# Altium project OSV PSB V2I1.PrjPcb (part 3 of 3)
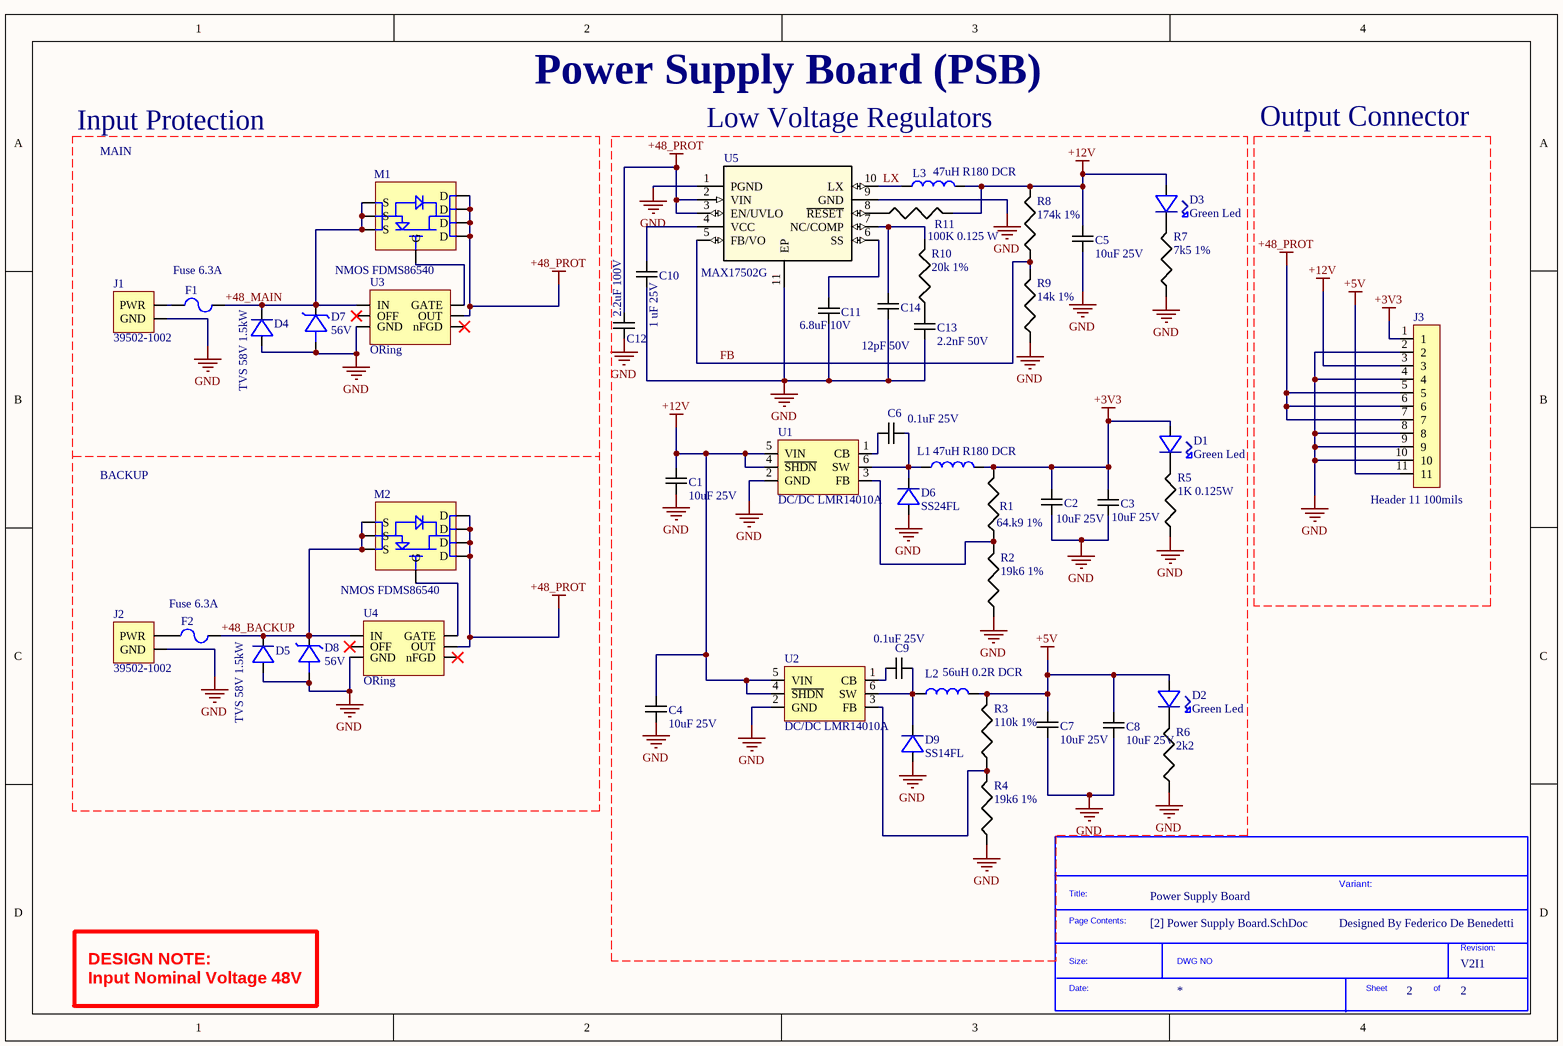
[diagram p3: [2] Power Supply Board.SchDoc]

## Sheet [2] Power Supply Board.SchDoc (continued)

### Library data of the parts (continued)
R10 = ERJ-6ENF2002V: Res Thick Film 0805 20K OHM 1% 1/8W 0805; Manufacturer: Panasonic; Resistance: 20kR; Power Rating: 125mW; Voltage Rating: 150V; Temperature Coefficient: 100ppm/°C; Supplier 1: Digi-Key; Manufacturer Part Number: ERJ-6ENF2002V; RoHS: Yes; Category: Chip SMD Resistors; Stock 1: 254204; Pricing 1: 1=0,10000, 10=0,07200, 100=0,02750, 1000=0,01210, 2500=0,01045 (USD); Mount: Surface Mount; Case/Package: 0805; Case Code (Metric): 2012; Case Code (Imperial): 0805; Contact Plating: Tin; Min Operating Temperature: -55°C; Max Operating Temperature: 155°C; Tolerance: 1%; Packaging: Tape and Reel; Package Quantity: 1; Composition: Thick Film; Number of Terminations: 2; Military Standard: Not; Termination: SMD/SMT; Max Power Dissipation: 125mW; Voltage Rating (DC): 150V; Features: Automotive AEC-Q200; Working Voltage: 150V; Length: 2mm; Height: 0.6mm; Width: 0.049inch; Depth: 1.25mm; Radiation Hardening: No; REACH SVHC: No SVHC; Lead Free: Lead Free; ComponentLink1URL: https://datasheet.ciiva.com/11821/0900766b80f80784-11821565.pdf?src-supplier=RSComponents; ComponentLink1Description: https://datasheet.ciiva.com/11821/0900766b80f80784-11821565.pdf?src-supplier=RSComponents; ComponentLink2URL: https://datasheet.ciiva.com/48531/aoa0000ce2-48531785.pdf?src-supplier=Avnet; ComponentLink2Description: https://datasheet.ciiva.com/48531/aoa0000ce2-48531785.pdf?src-supplier=Avnet; ComponentLink3URL: https://datasheet.ciiva.com/15159/getdatasheetpartid-249649-15159066.pdf?src-supplier=Verical; ComponentLink3Description: https://datasheet.ciiva.com/15159/getdatasheetpartid-249649-15159066.pdf?src-supplier=Verical; ComponentLink4URL: https://datasheet.ciiva.com/17211/aoa0000ce2-17211115.pdf?src-supplier=Avnet+Europe; ComponentLink4Description: https://datasheet.ciiva.com/17211/aoa0000ce2-17211115.pdf?src-supplier=Avnet+Europe; ComponentLink5URL: https://datasheet.ciiva.com/46389/426256-46389083.pdf?src-supplier=Element14; ComponentLink5Description: https://datasheet.ciiva.com/46389/426256-46389083.pdf?src-supplier=Element14; ComponentLink6URL: https://datasheet.ciiva.com/28688/1678782-28688637.pdf?src-supplier=Element14; ComponentLink6Description: https://datasheet.ciiva.com/28688/1678782-28688637.pdf?src-supplier=Element14; ComponentLink7URL: https://datasheet.ciiva.com/16512/aoa0000ce2-16512158.pdf?src-supplier=Avnet+Asia; ComponentLink7Description: https://datasheet.ciiva.com/16512/aoa0000ce2-16512158.pdf?src-supplier=Avnet+Asia; ComponentLink8URL: https://datasheet.ciiva.com/22749/1678782-22749662.pdf?src-supplier=Element14; ComponentLink8Description: https://datasheet.ciiva.com/22749/1678782-22749662.pdf?src-supplier=Element14; ComponentLink9URL: https://datasheet.ciiva.com/30072/aoa0000ce2-30072453.pdf?src-supplier=Onlinecomponents.com; ComponentLink9Description: https://datasheet.ciiva.com/30072/aoa0000ce2-30072453.pdf?src-supplier=Onlinecomponents.com; ComponentLink10URL: https://datasheet.ciiva.com/43460/426256-43460054.pdf?src-supplier=Farnell; ComponentLink10Description: https://datasheet.ciiva.com/43460/426256-43460054.pdf?src-supplier=Farnell; ComponentLink11URL: https://datasheet.ciiva.com/16786/70260748-16786968.pdf?src-supplier=Allied+Electronics; ComponentLink11Description: https://datasheet.ciiva.com/16786/70260748-16786968.pdf?src-supplier=Allied+Electronics; ComponentLink12URL: https://datasheet.ciiva.com/9192/aoa0000ce2-9192153.pdf?src-supplier=Avnet; ComponentLink12Description: https://datasheet.ciiva.com/9192/aoa0000ce2-9192153.pdf?src-supplier=Avnet; ComponentLink13URL: https://datasheet.ciiva.com/46377/426256-46377356.pdf?src-supplier=Element14; ComponentLink13Description: https://datasheet.ciiva.com/46377/426256-46377356.pdf?src-supplier=Element14; ComponentLink14URL: https://datasheet.ciiva.com/24025/aoa0000ce2-24025709.pdf?src-supplier=Mouser; ComponentLink14Description: https://datasheet.ciiva.com/24025/aoa0000ce2-24025709.pdf?src-supplier=Mouser; Supplier Part Number 1: P20.0KCCT-ND
R11 = ERJ-6ENF1003V: Res Thick Film 0805 100K Ohm 1% 0.125W(1/8W) ±100ppm/C Molded SMD Automotive Punched T/R; Manufacturer: Panasonic; Resistance: 100kR; Power Rating: 125mW; Temperature Coefficient: 100ppm/°C; Voltage Rating (DC): 150V; Supplier 1: Digi-Key; Manufacturer Part Number: ERJ-6ENF1003V; Stock 1: 2355717; Pricing 1: 1=0.1, 10=0.081, 100=0.0311, 1000=0.01367, 2500=0.01181 (USD); Mount: Surface Mount; Case/Package: 0805; Number of Pins: 2; Case Code (Metric): 2012; Case Code (Imperial): 0805; Contact Plating: Tin; Min Operating Temperature: -55°C; Max Operating Temperature: 155°C; Tolerance: 1%; Packaging: Tape and Reel; Number of Terminations: 2; Package Quantity: 1; Voltage Rating: 150V; Composition: Thick Film; Military Standard: Not; Termination: SMD/SMT; Max Power Dissipation: 125mW; Features: Automotive AEC-Q200; Length: 2mm; Height: 0.6mm; Width: 0.049inch; Depth: 1.25mm; Radiation Hardening: No; REACH SVHC: No SVHC; Lead Free: Lead Free; ComponentLink1URL: http://www.farnell.com/datasheets/426256.pdf; ComponentLink1Description: http://www.farnell.com/datasheets/426256.pdf; ComponentLink2URL: http://www.farnell.com/datasheets/1678782.pdf; ComponentLink2Description: http://www.farnell.com/datasheets/1678782.pdf; ComponentLink3URL: http://www.jameco.com/Jameco/Products/ProdDS/1988989.pdf; ComponentLink3Description: http://www.jameco.com/Jameco/Products/ProdDS/1988989.pdf; ComponentLink4URL: http://industrial.panasonic.com/www-data/pdf/AOA0000/AOA0000CE2.pdf; ComponentLink4Description: http://industrial.panasonic.com/www-data/pdf/AOA0000/AOA0000CE2.pdf; ComponentLink5URL: http://www.mouser.com/ds/2/315/AOA0000C283-1093288.pdf; ComponentLink5Description: http://www.mouser.com/ds/2/315/AOA0000C283-1093288.pdf; ComponentLink6URL: https://www.alliedelec.com/m/d/623f45ff1957d936ff56d46fd1c28cac.pdf; ComponentLink6Description: https://www.alliedelec.com/m/d/623f45ff1957d936ff56d46fd1c28cac.pdf; Supplier Part Number 1: P100KCDKR-ND
U1 U2 = LMR14010ADDCR: DC/DC Buck converter; Manufacturer: Texas Instruments; Output Type: Adjustable; Output Configuration: Positive; Number of Outputs: 1; Min Input Voltage: 4V; Max Input Voltage: 40V; Min Output Voltage: 765mV; Output Current: 1A; Switching Frequency: 850kHz; Synchronous Rectifier: No; Core Material: Ferrite; Tolerance: 20%; Inductance: 18uH; Current Rating: 2.45A; Saturation Current: 2A; Shielding: Unshielded; DC Resistance (DCR): 100mR; Self Resonant Frequency: 17.6MHz; Test Frequency: 1MHz; Supplier 1: Digi-Key; Manufacturer Part Number: LMR14010ADDCR; RoHS: No; Stock 1: 3166; Pricing 1: 1=2,34000, 10=2,09900, 25=1,98000, 100=1,58400, 250=1,38600, 500=1,34640, 1000=1,06920 (USD); Mount: Surface Mount; Case/Package: SOT-23-6; Min Operating Temperature: -40°C; Max Operating Temperature: 125°C; Features: UVLO; Packaging: Cut Tape; Max Output Voltage: 40V; ComponentLink1URL: http://www.ti.com/lit/ds/symlink/lmr14010a.pdf?src-supplier=Digi-Key; ComponentLink1Description: http://www.ti.com/lit/ds/symlink/lmr14010a.pdf?src-supplier=Digi-Key; ComponentLink2URL: http://www.ti.com/general/docs/suppproductinfo.tsp?distId=10&amp;gotoUrl=http%3A%2F%2Fwww.ti.com%2Flit%2Fgpn%2Flmr14010a&src-supplier=Digi-Key; ComponentLink2Description: http://www.ti.com/general/docs/suppproductinfo.tsp?distId=10&amp;gotoUrl=http%3A%2F%2Fwww.ti.com%2Flit%2Fgpn%2Flmr14010a&src-supplier=Digi-Key; Supplier Part Number 1: 296-49761-1-ND; Category: Fixed Inductors; Stock 2: 1808; Pricing 2: 1=0,74000, 10=0,64400, 100=0,46000, 500=0,38640 (USD); Composition: Wirewound; RMS Current (Irms): 2.45A; Termination: SMD/SMT; Inductance Tolerance: 20%; Length: 0.307inch; Width: 0.276inch; Height - Seated (Max): 0.217inch; Ratings: AEC-Q200; REACH SVHC: No SVHC; ComponentLink3URL: https://datasheet.ciiva.com/46449/1865596-46449257.pdf?src-supplier=Element14; ComponentLink3Description: https://datasheet.ciiva.com/46449/1865596-46449257.pdf?src-supplier=Element14; ComponentLink4URL: https://datasheet.ciiva.com/48954/70480897-48954489.pdf?src-supplier=Allied+Electronics; ComponentLink4Description: https://datasheet.ciiva.com/48954/70480897-48954489.pdf?src-supplier=Allied+Electronics
U3 U4 = LM5050MK-2/NOPB: IC OR CTRLR N+1 6SOT; Manufacturer: TI National Semiconductor; Quiescent Current: 400uA; Max Supply Voltage: 75V; Min Supply Voltage: 6V; Number of Outputs: 1; Operating Supply Current: 355uA; Max Output Voltage: 12V; Supplier 1: Digi-Key; Manufacturer Part Number: LM5050MK-2/NOPB; RoHS: Yes; Category: Uncategorized; Stock 1: 29342; Pricing 1: 1=2,21000, 10=1,98200, 25=1,87000, 100=1,49600, 250=1,30900, 500=1,27160 (USD); Mount: Surface Mount; Case/Package: SOT-23-6; Number of Pins: 6; Weight: 0.00127oz; Contact Plating: Tin; Min Operating Temperature: -40°C; Max Operating Temperature: 125°C; Packaging: Tape and Reel; Length: 3.05mm; Height: 1mm; Width: 1.75mm; Radiation Hardening: No; Lead Free: Lead Free; REACH SVHC: No SVHC; ComponentLink1URL: https://datasheet.ciiva.com/28632/1787943-28632260.pdf?src-supplier=Element14; ComponentLink1Description: https://datasheet.ciiva.com/28632/1787943-28632260.pdf?src-supplier=Element14; ComponentLink2URL: https://datasheet.ciiva.com/6609/lm5050-2-6609558.pdf?src-supplier=Digi-Key; ComponentLink2Description: https://datasheet.ciiva.com/6609/lm5050-2-6609558.pdf?src-supplier=Digi-Key; ComponentLink3URL: https://datasheet.ciiva.com/12085/lm5050-2-52065-12085161.pdf?src-supplier=Mouser; ComponentLink3Description: https://datasheet.ciiva.com/12085/lm5050-2-52065-12085161.pdf?src-supplier=Mouser; ComponentLink4URL: https://datasheet.ciiva.com/15110/getdatasheetpartid-494613-15110415.pdf?src-supplier=Verical; ComponentLink4Description: https://datasheet.ciiva.com/15110/getdatasheetpartid-494613-15110415.pdf?src-supplier=Verical; ComponentLink5URL: https://datasheet.ciiva.com/6609/lm5050-2-6609559.pdf?src-supplier=Digi-Key; ComponentLink5Description: https://datasheet.ciiva.com/6609/lm5050-2-6609559.pdf?src-supplier=Digi-Key; ComponentLink6URL: https://datasheet.ciiva.com/6609/lm5050-2-6609561.pdf?src-supplier=Digi-Key; ComponentLink6Description: https://datasheet.ciiva.com/6609/lm5050-2-6609561.pdf?src-supplier=Digi-Key; Supplier Part Number 1: LM5050MK-2/NOPBCT-ND
U5 = MAX17502GATB+T: DC/DC BUCK SYNC ADJ 1A 10TDFN; Manufacturer: Maxim; Switching Frequency: 600kHz; Efficiency: 90%; Max Input Voltage: 60V; Synchronous Rectifier: Yes; Output Voltage: 12V; Min Input Voltage: 4.5V; Nominal Supply Current: 4.75mA; Number of Outputs: 1; Output Type: Adjustable; Supplier 1: Digi-Key; Manufacturer Part Number: MAX17502GATB+T; RoHS: Yes; Category: Power Supply Modules; Stock 1: 970; Pricing 1: 1=3,37000, 10=3,02700, 25=2,86200, 100=2,35320, 250=2,11152, 500=2,06700 (USD); Number of Pins: 10; Min Operating Temperature: -40°C; Max Operating Temperature: 125°C; Max Output Current: 1A; Operating Supply Voltage: 60V; Packaging: Tape and Reel; Output Current: 1A; Package Quantity: 2500; Min Supply Voltage: 4.5V; ComponentLink1URL: https://datasheet.ciiva.com/14083/max17502-14083789.pdf?src-supplier=Digi-Key; ComponentLink1Description: https://datasheet.ciiva.com/14083/max17502-14083789.pdf?src-supplier=Digi-Key; Supplier Part Number 1: MAX17502GATB+TCT-ND